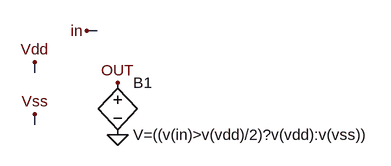
[diagram p0: schematic buff.asc]
buff.asc, the LTspice schematic file:
Version 4
SHEET 1 880 680
WIRE 144 48 128 48
WIRE 48 112 48 96
WIRE 48 192 48 176
FLAG 176 208 0
FLAG 176 128 OUT
FLAG 48 96 Vdd
FLAG 48 176 Vss
FLAG 128 48 in
SYMBOL bv 176 112 R0
SYMATTR InstName B1
SYMATTR Value V=((v(in)>v(vdd)/2)?v(vdd):v(vss))

The netlist it stands for:
* buff.asc
B1 OUT 0 V=((v(in)>v(vdd)/2)?v(vdd):v(vss))
.backanno
.end